# EAGLE design MEGA_MSX(A) (EAGLE 7.3.0)
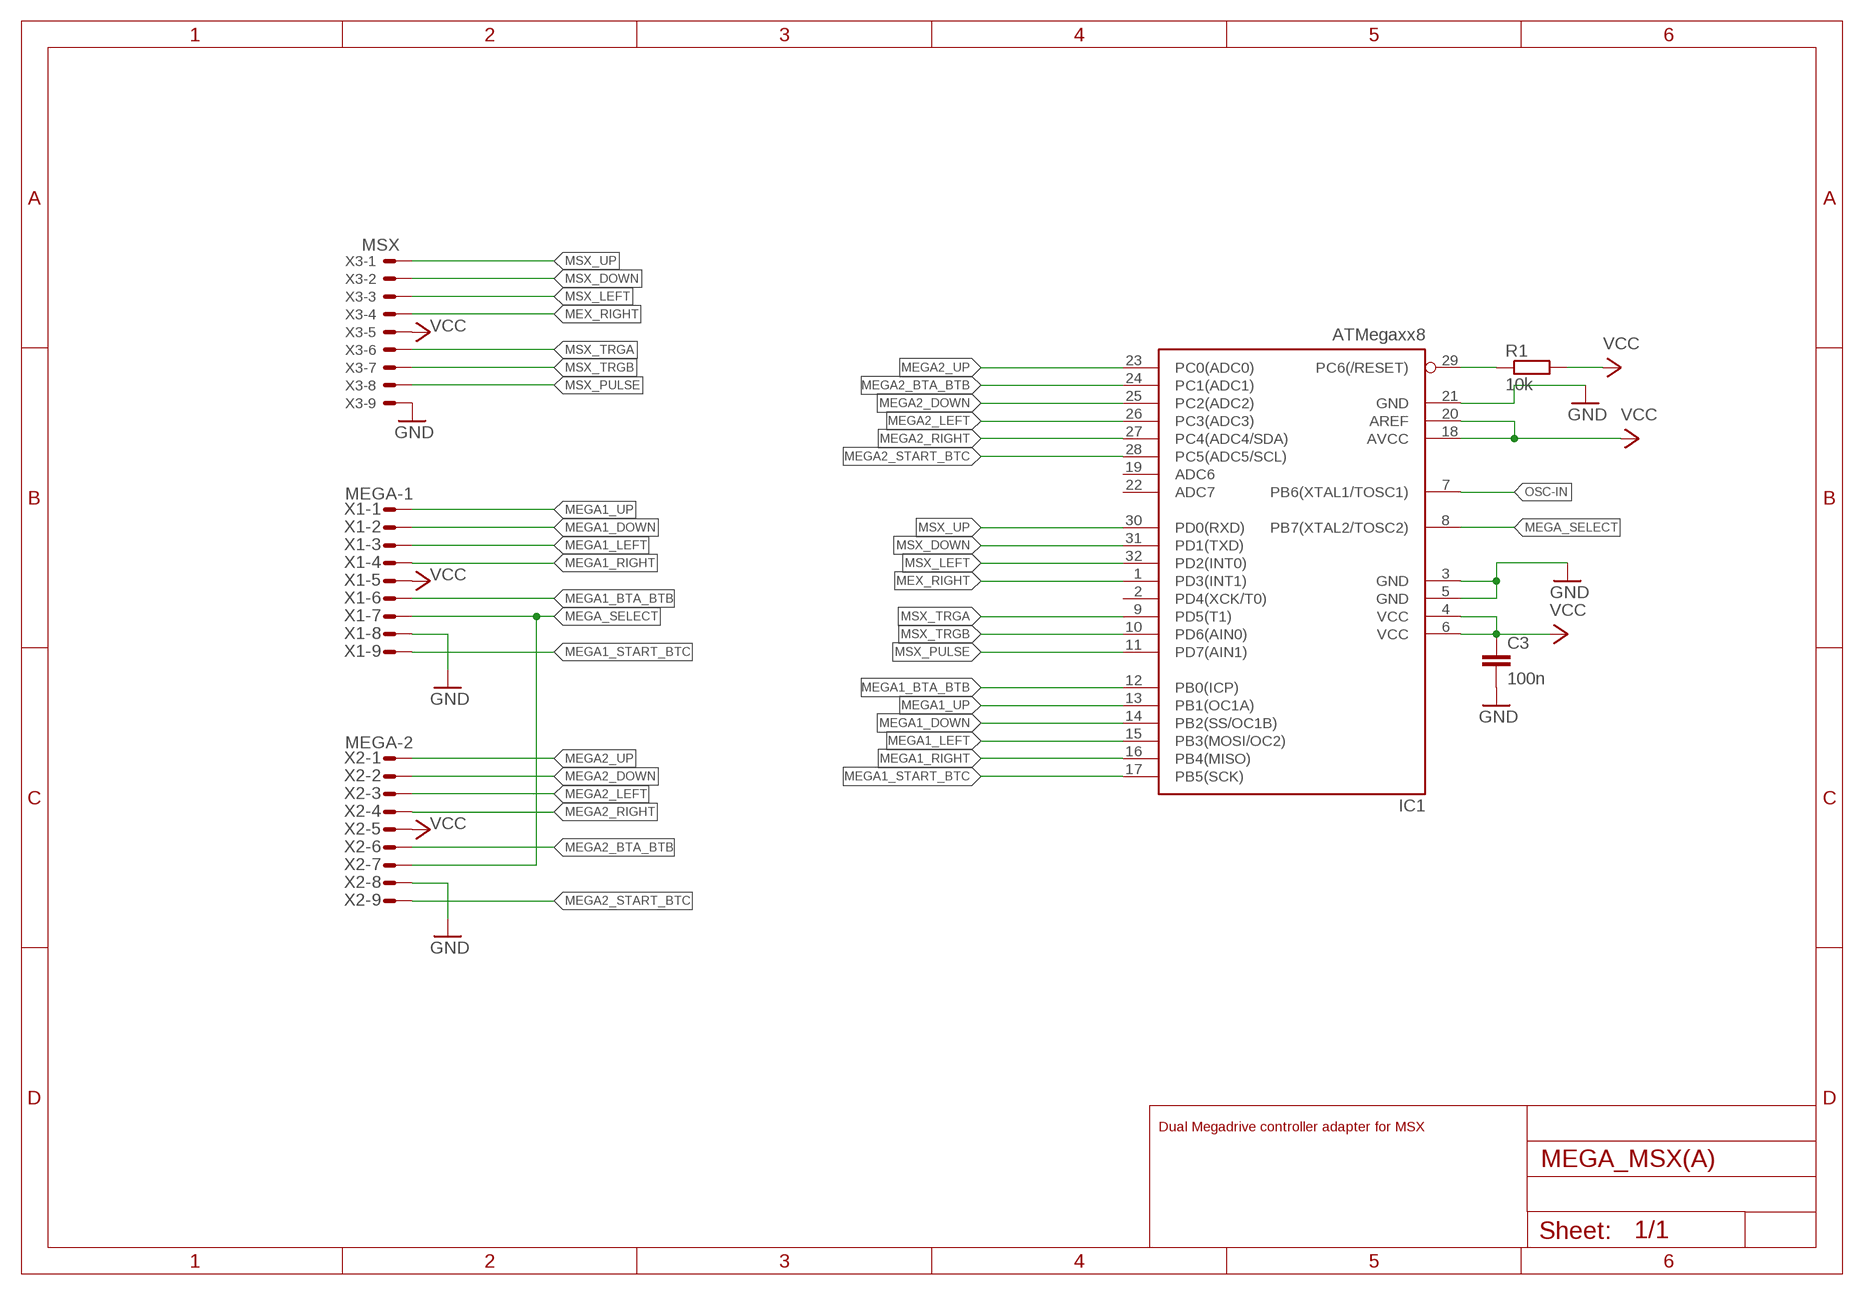
[diagram p0: schematic, sheet 1]

## Parts
C3  100n  C-EUC0805  [C0805]
IC1  ATMegaxx8  MEGA8-AI  [TQFP32-08]
R1  10k  R-EU_R0805  [R0805]
X1  MEGA-1  M09DS  [M09D]
X2  MEGA-2  M09DS  [M09D]
X3  MSX  22-23-2091  [22-23-2091]

## Nets
!RESET: IC1.29(PC6(/RESET)) R1.1
GND: C3.2 IC1.3(GND) IC1.5(GND) IC1.21(GND) X1.8 X2.8 X3.9
MEGA1_BTA_BTB: IC1.12(PB0(ICP)) X1.6
MEGA1_DOWN: IC1.14(PB2(SS/OC1B)) X1.2
MEGA1_LEFT: IC1.15(PB3(MOSI/OC2)) X1.3
MEGA1_RIGHT: IC1.16(PB4(MISO)) X1.4
MEGA1_START_BTC: IC1.17(PB5(SCK)) X1.9
MEGA1_UP: IC1.13(PB1(OC1A)) X1.1
MEGA2_BTA_BTB: IC1.24(PC1(ADC1)) X2.6
MEGA2_DOWN: IC1.25(PC2(ADC2)) X2.2
MEGA2_LEFT: IC1.26(PC3(ADC3)) X2.3
MEGA2_RIGHT: IC1.27(PC4(ADC4/SDA)) X2.4
MEGA2_START_BTC: IC1.28(PC5(ADC5/SCL)) X2.9
MEGA2_UP: IC1.23(PC0(ADC0)) X2.1
MEGA_SELECT: IC1.8(PB7(XTAL2/TOSC2)) X1.7 X2.7
MEX_RIGHT: IC1.1(PD3(INT1)) X3.4
MSX_DOWN: IC1.31(PD1(TXD)) X3.2
MSX_LEFT: IC1.32(PD2(INT0)) X3.3
MSX_PULSE: IC1.11(PD7(AIN1)) X3.8
MSX_TRGA: IC1.9(PD5(T1)) X3.6
MSX_TRGB: IC1.10(PD6(AIN0)) X3.7
MSX_UP: IC1.30(PD0(RXD)) X3.1
OSC-IN: IC1.7(PB6(XTAL1/TOSC1))
VCC: C3.1 IC1.4(VCC) IC1.6(VCC) IC1.18(AVCC) IC1.20(AREF) R1.2 X1.5 X2.5 X3.5
Unconnected: IC1.2(PD4(XCK/T0)) IC1.19(ADC6) IC1.22(ADC7)

## Notes on the sheet
- Dual Megadrive controller adapter for MSX

## Library data of the parts
C3 = rcl:C-EU: CAPACITOR, European symbol
IC1 = atmel:MEGA8: MICROCONTROLLER 8 Kbytes FLASH, 1 kbytes SRAM, 512 bytes EEPROM, USART, 6-channel 10 bit ADC, 2-channel 8 bit ADC Pin compatible with Atmega48, ATMega88, ATMega168 Source: avr.lbr; MPN: ATMEGA8-16AU; OC_FARNELL: 9171371; OC_NEWARK: 73M8863
R1 = rcl:R-EU_: RESISTOR, European symbol
X1 X2 = con-subd:M09?S: SUB-D; OC_FARNELL: unknown; OC_NEWARK: unknown
X3 = con-molex:22-23-2091: .100" (2.54mm) Center Header - 9 Pin; MF: MOLEX; MPN: 22-23-2091; OC_FARNELL: 1756827; OC_NEWARK: 56H0450

## Board
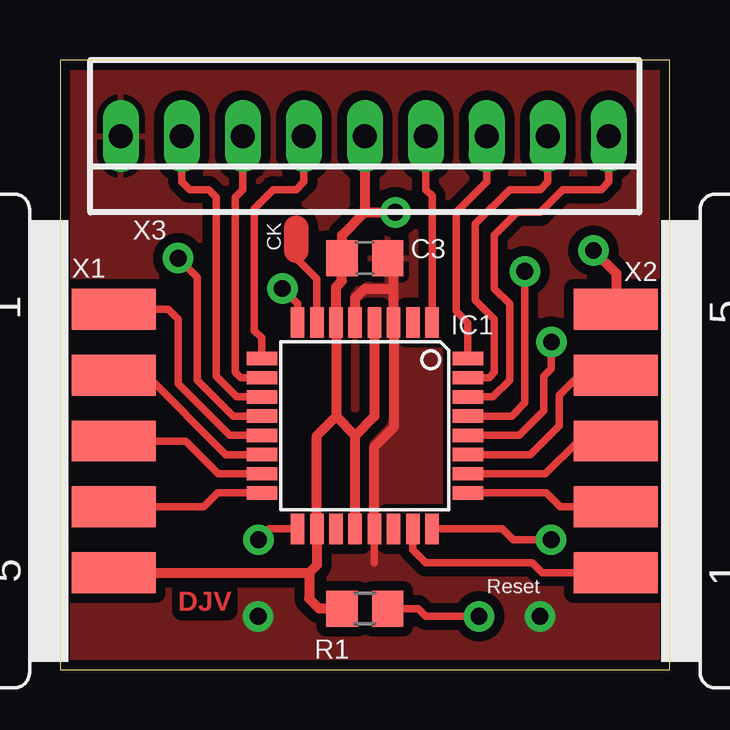
[diagram p1: board, top side]
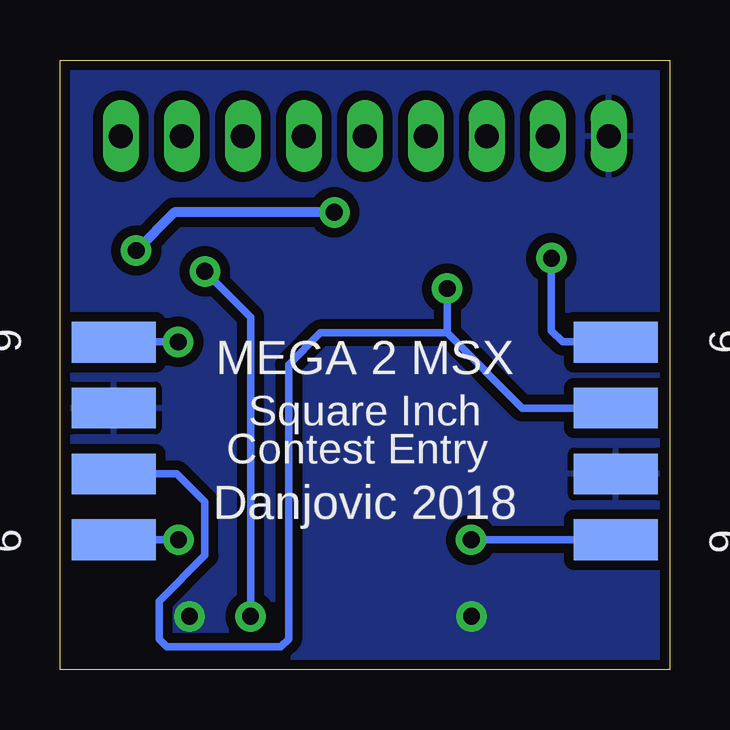
[diagram p2: board, bottom side, seen from below]

Size 25.4 x 25.4 mm. Coordinates in mm from the lower left corner, seen from the top.
Outline: 0,0 25.4,0 25.4,25.4 0,25.4 0,0
Copper layers (1*16): Top 0.0356mm / dielectric 1.5011mm / Bottom 0.0356mm
Design rules "LaenPCBOrder *": minimum track width 6mil, minimum drill 13mil, track to track 6mil, track to pad 6mil, pad to pad 6mil, via to via 6mil, smd to smd 6mil, copper to edge 15mil, drill to drill 6mil, minimum pad ring 7mil, minimum via ring 7mil, stop-mask expansion 3mil, vias tented up to drill 0mil, thermal gap 10mil

### Footprints (pad centres in the part's own frame; a part is rotated, then mirrored left to right if it is on the bottom)
C0805 = smd 1.3 x 1.5: 1 -0.95,0; 2 0.95,0
TQFP32-08 = smd 1.27 x 0.559: 1 -4.293,2.8; 2 -4.293,2; 3 -4.293,1.2; 4 -4.293,0.4; 5 -4.293,-0.4; 6 -4.293,-1.2; 7 -4.293,-2; 8 -4.293,-2.8; 17 4.293,-2.8; 18 4.293,-2; 19 4.293,-1.2; 20 4.293,-0.4; 21 4.293,0.4; 22 4.293,1.2; 23 4.293,2; 24 4.293,2.8 | smd 0.559 x 1.27: 9 -2.8,-4.293; 10 -2,-4.293; 11 -1.2,-4.293; 12 -0.4,-4.293; 13 0.4,-4.293; 14 1.2,-4.293; 15 2,-4.293; 16 2.8,-4.293; 25 2.8,4.293; 26 2,4.293; 27 1.2,4.293; 28 0.4,4.293; 29 -0.4,4.293; 30 -1.2,4.293; 31 -2,4.293; 32 -2.8,4.293
R0805 = smd 1.3 x 1.5: 1 -0.95,0; 2 0.95,0
M09D = smd 1.7 x 3.5: 1 5.486,-6.045; 2 2.743,-6.045; 3 0,-6.045; 4 -2.743,-6.045; 5 -5.486,-6.045 | smd 1.7 x 3.5 bottom: 6 4.115,-6.045; 7 1.372,-6.045; 8 -1.372,-6.045; 9 -4.115,-6.045
22-23-2091 = drill 1 long: 1 -10.16,0; 2 -7.62,0; 3 -5.08,0; 4 -2.54,0; 5 0,0; 6 2.54,0; 7 5.08,0; 8 7.62,0; 9 10.16,0

### Placement (x,y rotation side)
C3  12.7,17.14 0 top
IC1  12.7,10.16 270 top
R1  12.7,2.54 180 top
X1  -3.81,9.53 90 top
X2  29.21,9.53 270 top
X3  12.7,22.23 180 top

### Tracks (layer width: path | path; a pad name or v marks a point on that pad's centre or on a via)
!RESET  (via drill 0.7 pad 1.27)
  Top 0.305: IC1.29 18.82,10.56 19.37,11.11 v19.37,16.59 | R1.1 14.92,2.54 15.24,2.22 v17.46,2.22
  Bottom 0.305: v17.46,2.22 17.46,14.69 v19.37,16.59
GND  (via drill 0.7 pad 1.27)
  Top 0.305: IC1.21 13.1,4.45
  Top 0.406: 13.9,15.88 IC1.3 13.9,10.09 13.1,9.29 IC1.21 | 13.9,15.88 13.9,17.08 | IC1.5 12.3,15.47 12.7,15.88 13.9,15.88
  other vias: 8.26,2.22 20,2.22
  pour Top (isolate 0.406): 0,25.4 0,0 25.4,0 25.4,25.4
  pour Bottom (isolate 0.406): 25.4,0 25.4,25.4 0,25.4 0,0
MEGA1_BTA_BTB  (via drill 0.7 pad 1.27)
  Top 0.305: IC1.12 7.22,10.56 5.71,12.06 5.71,16.35 v4.92,17.14
  Bottom 0.305: X1.6 2.25,13.65 4.45,13.65 4.92,14.13 v4.92,17.14
MEGA1_DOWN
  Top 0.305: X1.2 3.61,12.27 6.92,8.96 IC1.14
MEGA1_LEFT
  Top 0.305: X1.3 5.24,9.53 6.6,8.16 IC1.15
MEGA1_RIGHT
  Top 0.305: IC1.16 6.57,7.36 5.99,6.78 X1.4
MEGA1_START_BTC  (via drill 0.7 pad 1.27)
  Top 0.305: IC1.17 8.72,5.87 v8.27,5.41
  Bottom 0.305: X1.9 v8.27,5.41
MEGA1_UP
  Top 0.305: X1.1 4.51,15.01 4.92,14.61 4.92,11.91 7.07,9.76 IC1.13
MEGA2_BTA_BTB  (via drill 0.7 pad 1.27)
  Top 0.305: IC1.24 18.42,5.87 18.88,5.41 v20.47,5.41
  Bottom 0.305: X2.6 v20.47,5.41
MEGA2_DOWN
  Top 0.305: IC1.25 20.26,7.36 20.84,6.78 X2.2
MEGA2_LEFT
  Top 0.305: X2.3 21.59,9.53 20.23,8.16 IC1.26
MEGA2_RIGHT
  Top 0.305: IC1.27 19.6,8.96 20.8,10.16 20.8,11.43 21.43,12.06 22.96,12.06 X2.4
MEGA2_START_BTC  (via drill 0.7 pad 1.27)
  Top 0.305: IC1.28 19.13,9.76 20.16,10.79 20.16,12.22 20.48,12.54 v20.48,13.65
  Bottom 0.305: X2.9 21.92,13.64 21.91,13.65 v20.48,13.65
MEGA2_UP
  Top 0.305: IC1.23 14.7,4.99 15.24,4.45 19.68,4.45 20.09,4.04 X2.1
MEGA_SELECT  (via drill 0.7 pad 1.27)
  Top 0.305: IC1.8 9.9,15.24 v9.27,15.88
  Bottom 0.305: X1.7 6.13,10.9 9.27,14.03 | X2.7 20.54,8.15 19.37,6.99 19.37,4.76 21.27,2.86 21.27,1.27 20.95,0.95 16.19,0.95 15.88,1.27 15.88,12.7 14.55,14.03 9.27,14.03 | v9.27,15.88 9.27,14.03
MEX_RIGHT
  Top 0.305: IC1.1 15.5,19.74 15.24,20 X3.4
MSX_DOWN
  Top 0.305: IC1.31 17.88,12.16 18.1,12.38 18.1,14.61 17.3,15.4 17.3,18.57 18.73,20 20,20 20.32,20.32 X3.2
MSX_LEFT
  Top 0.305: IC1.32 16.99,14.44 16.51,14.92 16.51,19.05 17.78,20.32 X3.3
MSX_PULSE
  Top 0.305: IC1.11 7.37,11.36 6.51,12.22 6.51,19.68 6.19,20 5.4,20 5.08,20.32 X3.8
MSX_TRGA
  Top 0.305: X3.6 10.16,20.32 9.84,20 8.89,20 8.1,19.21 8.1,14.13 8.41,13.82 IC1.9
MSX_TRGB
  Top 0.305: IC1.10 7.53,12.16 7.3,12.38 7.3,19.68 7.62,20 X3.7
MSX_UP
  Top 0.305: IC1.30 18.03,11.36 18.73,12.06 18.73,15.24 18.1,15.88 18.1,18.1 19.05,19.05 20,19.05 20.95,20 22.54,20 22.86,20.32 X3.1
OSC-IN
  Top 0.305: IC1.7 10.7,16.29 9.84,17.14 9.84,17.46
  Top 1.016: 9.84,18.41 9.84,17.46
VCC  (via drill 0.7 pad 1.27)
  Top 0.305: C3.1
  Top 0.406: 11.5,10.55 IC1.6 11.5,15.95 11.75,16.19 C3.1 11.75,18.1 12.7,19.05 | 11.5,10.55 10.7,9.75 IC1.18 10.7,4.36 10.38,4.04 | IC1.20 12.3,9.75 | 12.3,9.75 11.5,10.55 | IC1.4 13.1,10.55 12.3,9.75 | X3.5 12.7,19.05 | 12.7,19.05 v13.97,19.05 | X1.5 10.38,4.04 | R1.2 10.79,2.54 10.38,2.95 10.38,4.04 | v22.23,17.46 23.18,16.51 23.18,15.02 X2.5
  Bottom 0.406: v13.97,19.05 20.64,19.05 v22.23,17.46

### Text on the board
Top: DJV
tNames: CK | Reset
bNames: MEGA 2 MSX | Square Inch | Contest Entry | Danjovic 2018